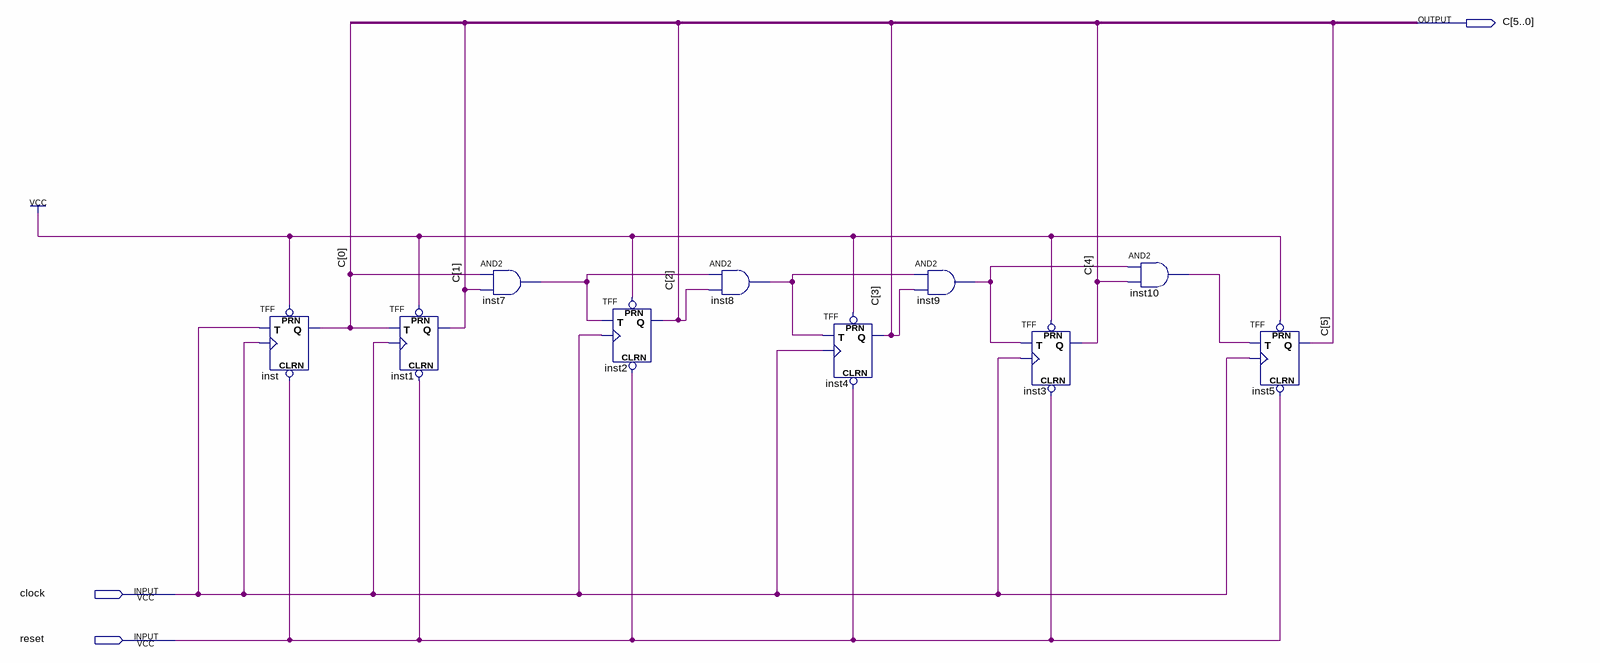
[diagram p0: schematic sheet]
// Quartus schematic contador.bdf as structural Verilog: 10 symbols, 3 pins
module contador (
  input  clock,
  input  reset,
  output [5:0] C
);

  wire inst7_out, inst8_out, inst9_out, inst10_out;

  TFF inst (.PRN(1'b1), .CLRN(reset), .T(clock), .CLK(clock), .Q(C[0]));
  TFF inst1 (.PRN(1'b1), .CLRN(reset), .T(C[0]), .CLK(clock), .Q(C[1]));
  and inst7 (inst7_out, C[0], C[1]);
  TFF inst2 (.PRN(1'b1), .CLRN(reset), .T(inst7_out), .CLK(clock), .Q(C[2]));
  and inst8 (inst8_out, inst7_out, C[2]);
  TFF inst4 (.PRN(1'b1), .CLRN(reset), .T(inst8_out), .CLK(clock), .Q(C[3]));
  and inst9 (inst9_out, inst8_out, C[3]);
  TFF inst3 (.PRN(1'b1), .CLRN(reset), .T(inst9_out), .CLK(clock), .Q(C[4]));
  and inst10 (inst10_out, inst9_out, C[4]);
  TFF inst5 (.PRN(1'b1), .CLRN(reset), .T(inst10_out), .CLK(clock), .Q(C[5]));
endmodule
